# Altium schematic sheet Date.SchDoc: Date
size A4; Author: Othniel Konan; DrawnBy: Othniel Konan; Engineer: Othniel Konan; Organization: Othniel Konan; Address1: NPSC; Address2: Othnie Konan; Address3: ECE 2017; DocumentNumber: 1; Revision: 1.0; SheetNumber: 1; SheetTotal: 1; ProjectName: NPC
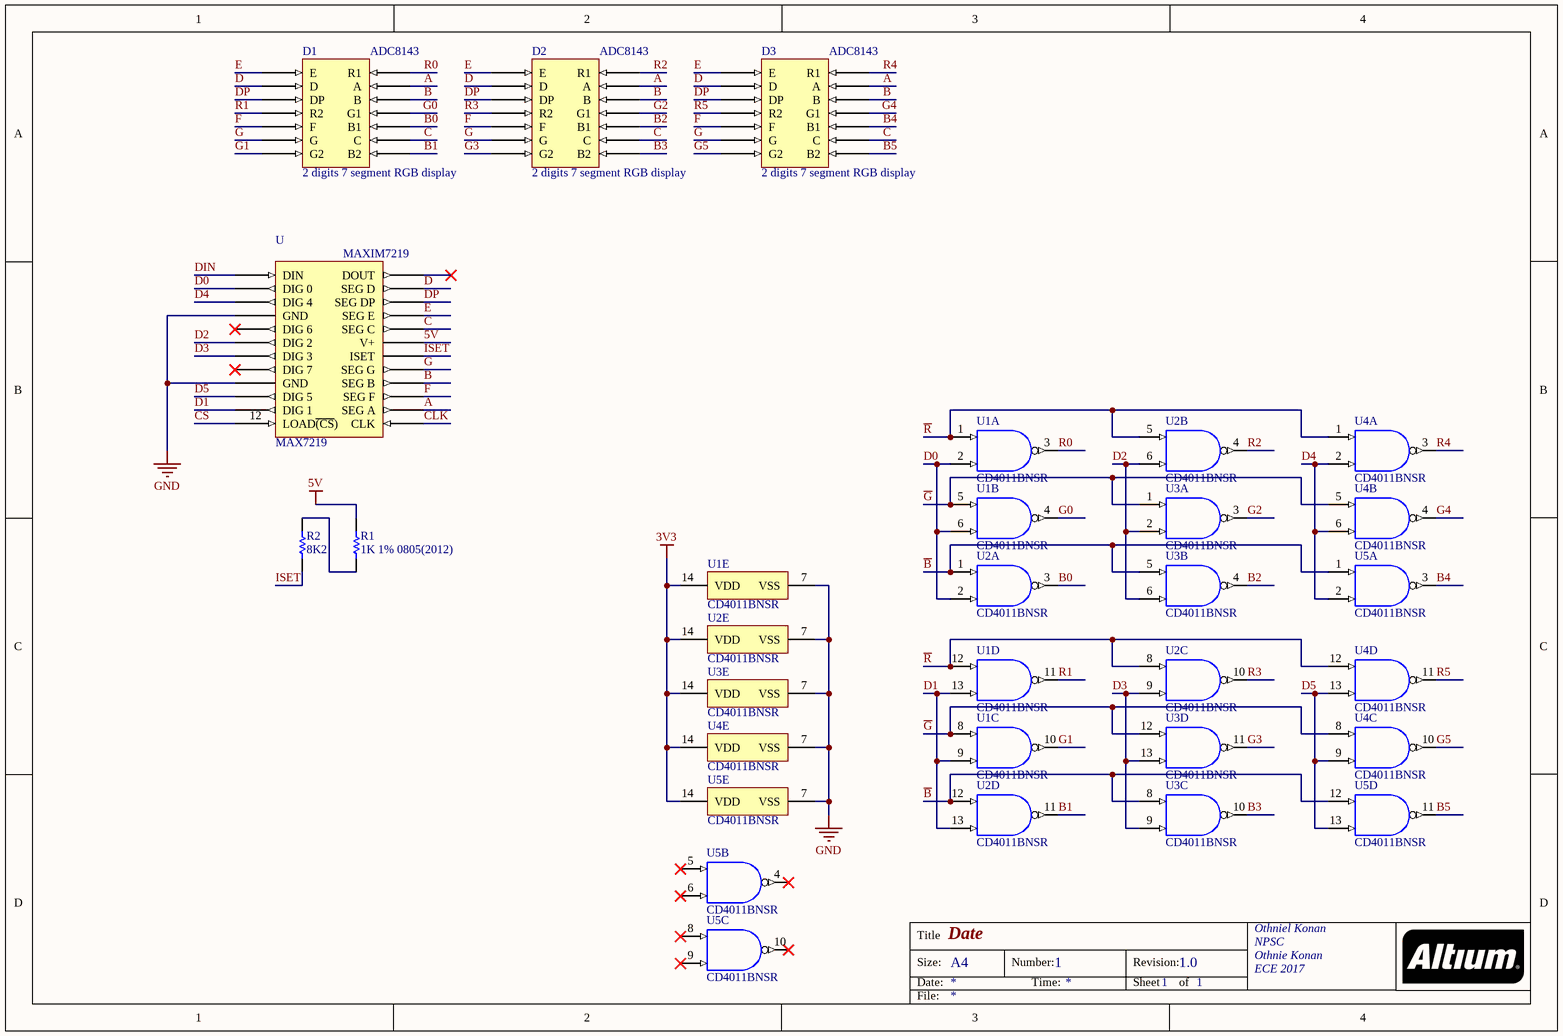
[diagram p0: Date.SchDoc]

## Parts
D1  2 digits 7 segment RGB display  [ACD8143]
D2  2 digits 7 segment RGB display  [ACD8143]
D3  2 digits 7 segment RGB display  [ACD8143]
R1  1K 1% 0805(2012)  [RESC0805(2012)_M]
R2  8K2  [RESC0805(2012)_M]
U  MAX7219  [SOIC127P1030X235-24N]
U1  CD4011BNSR  [NS0014A_N]  (parts A,B,C,D,E of 5)
U2  CD4011BNSR  [NS0014A_N]  (parts A,B,C,D,E of 5)
U3  CD4011BNSR  [NS0014A_N]  (parts A,B,C,D,E of 5)
U4  CD4011BNSR  [NS0014A_N]  (parts A,B,C,D,E of 5)
U5  CD4011BNSR  [NS0014A_N]  (parts A,B,C,D,E of 5)

## Nets
3V3: U1.14(VDD) U2.14(VDD) U3.14(VDD) U4.14(VDD) U5.14(VDD)
5V: R1.1 U.19(V+)
GND: U.4(GND) U.9(GND) U1.7(VSS) U2.7(VSS) U3.7(VSS) U4.7(VSS) U5.7(VSS)
~{B}: U2.1(A) U2.12(G) U3.5(C) U3.8(E) U5.1(A) U5.12(G)
~{CS}: U.12(LOAD~{(CS}))
~{G}: U1.5(C) U1.8(E) U3.1(A) U3.12(G) U4.5(C) U4.8(E)
~{R}: U1.1(A) U1.12(G) U2.5(C) U2.8(E) U4.1(A) U4.12(G)
A: D1.13(A) D2.13(A) D3.13(A) U.14(SEG_A)
B: D1.12(B) D2.12(B) D3.12(B) U.16(SEG_B)
B0: D1.10(B1) U2.3(J)
B1: D1.8(B2) U2.11(M)
B2: D2.10(B1) U3.4(K)
B3: D2.8(B2) U3.10(L)
B4: D3.10(B1) U5.3(J)
B5: D3.8(B2) U5.11(M)
C: D1.9(C) D2.9(C) D3.9(C) U.20(SEG_C)
CLK: U.13(CLK)
D: D1.2(D) D2.2(D) D3.2(D) U.23(SEG_D)
D0: U.2(DIG_0) U1.2(B) U1.6(D) U2.2(B)
D1: U.11(DIG_1) U1.9(F) U1.13(H) U2.13(H)
D2: U.6(DIG_2) U2.6(D) U3.2(B) U3.6(D)
D3: U.7(DIG_3) U2.9(F) U3.9(F) U3.13(H)
D4: U.3(DIG_4) U4.2(B) U4.6(D) U5.2(B)
D5: U.10(DIG_5) U4.9(F) U4.13(H) U5.13(H)
DIN: U.1(DIN)
DP: D1.3(DP) D2.3(DP) D3.3(DP) U.22(SEG_DP)
E: D1.1(E) D2.1(E) D3.1(E) U.21(SEG_E)
F: D1.5(F) D2.5(F) D3.5(F) U.15(SEG_F)
G: D1.6(G) D2.6(G) D3.6(G) U.17(SEG_G)
G0: D1.11(G1) U1.4(K)
G1: D1.7(G2) U1.10(L)
G2: D2.11(G1) U3.3(J)
G3: D2.7(G2) U3.11(M)
G4: D3.11(G1) U4.4(K)
G5: D3.7(G2) U4.10(L)
ISET: R2.2 U.18(ISET)
R0: D1.14(R1) U1.3(J)
R1: D1.4(R2) U1.11(M)
R2: D2.14(R1) U2.4(K)
R3: D2.4(R2) U2.10(L)
R4: D3.14(R1) U4.3(J)
R5: D3.4(R2) U4.11(M)
NetR1_2: R1.2 R2.1

Not connected (* = marked no-connect by the designer): U 5(DIG_6)* 8(DIG_7)* 24(DOUT)*; U5 4(K)* 5(C)* 6(D)* 8(E)* 9(F)* 10(L)*

## Notes on the sheet
- Title
- Size:
- Date:
- A4
- Number:
- Time:
- Revision:
- Sheet
- of
- File:
- (in symbol ACD8143) ADC8143
- (in symbol MAX7219) MAXIM7219

## Library data of the parts
D1-D3 = ACD8143
R1 = CMP-1013-00954-1: 8M45 0.125W 1% 0805 (2012 Metric)  SMD; Case-EIA: 0805; Case-Metric: 2012; Value: 1000.00 Ohm; Technology: SMT; Power: 0.125 W; Tolerance: 1 %
R2 = CMP-1013-00954-1: 8K2 0.125W 1% 0805 (2012 Metric)  SMD; Case-EIA: 0805; Case-Metric: 2012; Value: 8200.00 Ohm; Technology: SMT; Power: 0.125 W; Tolerance: 1 %
U = MAX7219: Serial Interface, 8-Digit LED Display Drivers
U1-U5 = CMP-1627-00522-3: CMOS Quad 2-Input NAND Gate, NS0014A, LARGE T&R; Manufacturer: Texas Instruments; VCC(Max)(V): 18; VCC(Min)(V): 3; Output Drive (IOL/IOH)(Max)(mA): 1.5/-1.5; ICC @ Nom Voltage(Max)(mA): 0.015; F @ Nom Voltage(Max)(Mhz): 8; Schmitt Trigger: No; Bits(#): 4; Technology Family: CD4000; Voltage(Nom)(V): 10; Rating: Military; PackageReference: NS0014A; Input Type: CMOS; Output Type: CMOS; DatasheetVersion: SCHS021D; Operating Temperature Range(C): -55 to 125; Generic Part Number: CD4011B